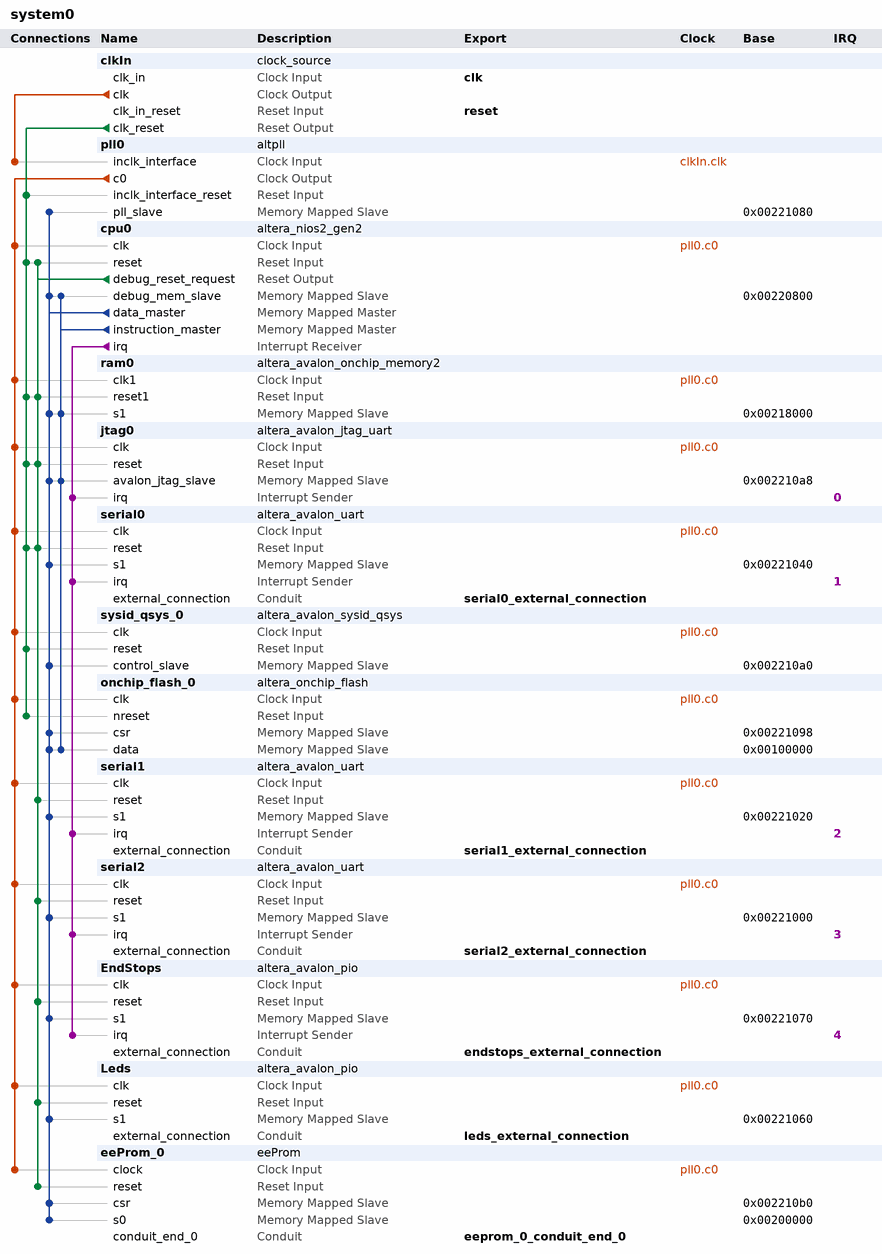
[diagram p0: system contents]
# Platform Designer (Qsys) system system0, MAX 10 10M25SAE144C8G
# Parameters at their usual value, and those the tool derives, are not listed.
package require -exact qsys 18.1
create_system system0
set_project_property DEVICE_FAMILY {MAX 10}
set_project_property DEVICE 10M25SAE144C8G

add_instance clkIn clock_source 18.1
set_instance_parameter_value clkIn clockFrequency 50000000

add_instance pll0 altpll 18.1
set_instance_parameter_value pll0 CLK0_DIVIDE_BY 5
set_instance_parameter_value pll0 CLK0_MULTIPLY_BY 11
set_instance_parameter_value pll0 CLK1_DIVIDE_BY 1
set_instance_parameter_value pll0 CLK1_DUTY_CYCLE 50
set_instance_parameter_value pll0 CLK1_MULTIPLY_BY 1
set_instance_parameter_value pll0 CLK1_PHASE_SHIFT 0
set_instance_parameter_value pll0 CLK2_DIVIDE_BY 2
set_instance_parameter_value pll0 CLK2_DUTY_CYCLE 50
set_instance_parameter_value pll0 CLK2_MULTIPLY_BY 1
set_instance_parameter_value pll0 CLK2_PHASE_SHIFT 0
set_instance_parameter_value pll0 INCLK0_INPUT_FREQUENCY 20000
set_instance_parameter_value pll0 PORT_ARESET PORT_UNUSED
set_instance_parameter_value pll0 PORT_LOCKED PORT_UNUSED
set_instance_parameter_value pll0 PORT_clk1 PORT_USED
set_instance_parameter_value pll0 PORT_clk2 PORT_UNUSED
set_instance_parameter_value pll0 PORT_clk3 PORT_UNUSED

add_instance cpu0 altera_nios2_gen2 18.1
set_instance_parameter_value cpu0 dcache_size 2048
set_instance_parameter_value cpu0 exceptionSlave ram0.s1
set_instance_parameter_value cpu0 icache_size 4096
set_instance_parameter_value cpu0 impl Tiny
set_instance_parameter_value cpu0 resetSlave ram0.s1

add_instance ram0 altera_avalon_onchip_memory2 18.1
set_instance_parameter_value ram0 dataWidth 32
set_instance_parameter_value ram0 dualPort false
set_instance_parameter_value ram0 initMemContent false
set_instance_parameter_value ram0 initializationFileName onchip_mem.hex
set_instance_parameter_value ram0 memorySize 30720

add_instance jtag0 altera_avalon_jtag_uart 18.1
set_instance_parameter_value jtag0 simInteractiveOptions NO_INTERACTIVE_WINDOWS

add_instance serial0 altera_avalon_uart 18.1
set_instance_parameter_value serial0 baud 115200
set_instance_parameter_value serial0 dataBits 8
set_instance_parameter_value serial0 fixedBaud true
set_instance_parameter_value serial0 parity NONE
set_instance_parameter_value serial0 stopBits 1

add_instance sysid_qsys_0 altera_avalon_sysid_qsys 18.1
set_instance_parameter_value sysid_qsys_0 id -1841766281

add_instance onchip_flash_0 altera_onchip_flash 18.1
set_instance_parameter_value onchip_flash_0 CLOCK_FREQUENCY 110.0
set_instance_parameter_value onchip_flash_0 CONFIGURATION_MODE {Single Compressed Image}
set_instance_parameter_value onchip_flash_0 SECTOR_ACCESS_MODE {Read and write,Read and write,Read and write,Read and write,Read and write}
set_instance_parameter_value onchip_flash_0 initFlashContent false
set_instance_parameter_value onchip_flash_0 initializationFileName altera_onchip_flash.hex
set_instance_parameter_value onchip_flash_0 useNonDefaultInitFile false

add_instance serial1 altera_avalon_uart 18.1
set_instance_parameter_value serial1 baud 115200
set_instance_parameter_value serial1 dataBits 8
set_instance_parameter_value serial1 fixedBaud false
set_instance_parameter_value serial1 parity NONE
set_instance_parameter_value serial1 stopBits 1

add_instance serial2 altera_avalon_uart 18.1
set_instance_parameter_value serial2 baud 115200
set_instance_parameter_value serial2 dataBits 8
set_instance_parameter_value serial2 fixedBaud false
set_instance_parameter_value serial2 parity NONE
set_instance_parameter_value serial2 stopBits 1

add_instance EndStops altera_avalon_pio 18.1
set_instance_parameter_value EndStops captureEdge true
set_instance_parameter_value EndStops direction Input
set_instance_parameter_value EndStops generateIRQ true
set_instance_parameter_value EndStops irqType EDGE
set_instance_parameter_value EndStops width 8

add_instance Leds altera_avalon_pio 18.1
set_instance_parameter_value Leds direction Output
set_instance_parameter_value Leds width 4

add_instance eeProm_0 eeProm 1.0
set_instance_parameter_value eeProm_0 i2cClockRate 1000000

# connections
add_connection clkIn.clk pll0.inclk_interface clock
add_connection pll0.c0 cpu0.clk clock
add_connection pll0.c0 eeProm_0.clock clock
add_connection pll0.c0 EndStops.clk clock
add_connection pll0.c0 jtag0.clk clock
add_connection pll0.c0 Leds.clk clock
add_connection pll0.c0 onchip_flash_0.clk clock
add_connection pll0.c0 ram0.clk1 clock
add_connection pll0.c0 serial0.clk clock
add_connection pll0.c0 serial1.clk clock
add_connection pll0.c0 serial2.clk clock
add_connection pll0.c0 sysid_qsys_0.clk clock
add_connection clkIn.clk_reset cpu0.reset reset
add_connection clkIn.clk_reset jtag0.reset reset
add_connection clkIn.clk_reset onchip_flash_0.nreset reset
add_connection clkIn.clk_reset pll0.inclk_interface_reset reset
add_connection clkIn.clk_reset ram0.reset1 reset
add_connection clkIn.clk_reset serial0.reset reset
add_connection clkIn.clk_reset sysid_qsys_0.reset reset
add_connection cpu0.debug_reset_request cpu0.reset reset
add_connection cpu0.debug_reset_request eeProm_0.reset reset
add_connection cpu0.debug_reset_request EndStops.reset reset
add_connection cpu0.debug_reset_request jtag0.reset reset
add_connection cpu0.debug_reset_request Leds.reset reset
add_connection cpu0.debug_reset_request ram0.reset1 reset
add_connection cpu0.debug_reset_request serial0.reset reset
add_connection cpu0.debug_reset_request serial1.reset reset
add_connection cpu0.debug_reset_request serial2.reset reset
add_connection cpu0.data_master cpu0.debug_mem_slave avalon
set_connection_parameter_value cpu0.data_master/cpu0.debug_mem_slave baseAddress 0x00220800
add_connection cpu0.data_master eeProm_0.csr avalon
set_connection_parameter_value cpu0.data_master/eeProm_0.csr baseAddress 0x002210b0
add_connection cpu0.data_master eeProm_0.s0 avalon
set_connection_parameter_value cpu0.data_master/eeProm_0.s0 baseAddress 0x00200000
add_connection cpu0.data_master EndStops.s1 avalon
set_connection_parameter_value cpu0.data_master/EndStops.s1 baseAddress 0x00221070
add_connection cpu0.data_master jtag0.avalon_jtag_slave avalon
set_connection_parameter_value cpu0.data_master/jtag0.avalon_jtag_slave baseAddress 0x002210a8
add_connection cpu0.data_master Leds.s1 avalon
set_connection_parameter_value cpu0.data_master/Leds.s1 baseAddress 0x00221060
add_connection cpu0.data_master onchip_flash_0.csr avalon
set_connection_parameter_value cpu0.data_master/onchip_flash_0.csr baseAddress 0x00221098
add_connection cpu0.data_master onchip_flash_0.data avalon
set_connection_parameter_value cpu0.data_master/onchip_flash_0.data baseAddress 0x00100000
add_connection cpu0.data_master pll0.pll_slave avalon
set_connection_parameter_value cpu0.data_master/pll0.pll_slave baseAddress 0x00221080
add_connection cpu0.data_master ram0.s1 avalon
set_connection_parameter_value cpu0.data_master/ram0.s1 baseAddress 0x00218000
add_connection cpu0.data_master serial0.s1 avalon
set_connection_parameter_value cpu0.data_master/serial0.s1 baseAddress 0x00221040
add_connection cpu0.data_master serial1.s1 avalon
set_connection_parameter_value cpu0.data_master/serial1.s1 baseAddress 0x00221020
add_connection cpu0.data_master serial2.s1 avalon
set_connection_parameter_value cpu0.data_master/serial2.s1 baseAddress 0x00221000
add_connection cpu0.data_master sysid_qsys_0.control_slave avalon
set_connection_parameter_value cpu0.data_master/sysid_qsys_0.control_slave baseAddress 0x002210a0
add_connection cpu0.instruction_master cpu0.debug_mem_slave avalon
set_connection_parameter_value cpu0.instruction_master/cpu0.debug_mem_slave baseAddress 0x00220800
add_connection cpu0.instruction_master jtag0.avalon_jtag_slave avalon
set_connection_parameter_value cpu0.instruction_master/jtag0.avalon_jtag_slave baseAddress 0x002210a8
add_connection cpu0.instruction_master onchip_flash_0.data avalon
set_connection_parameter_value cpu0.instruction_master/onchip_flash_0.data baseAddress 0x00100000
add_connection cpu0.instruction_master ram0.s1 avalon
set_connection_parameter_value cpu0.instruction_master/ram0.s1 baseAddress 0x00218000
add_connection cpu0.irq EndStops.irq interrupt
set_connection_parameter_value cpu0.irq/EndStops.irq irqNumber 4
add_connection cpu0.irq jtag0.irq interrupt
set_connection_parameter_value cpu0.irq/jtag0.irq irqNumber 0
add_connection cpu0.irq serial0.irq interrupt
set_connection_parameter_value cpu0.irq/serial0.irq irqNumber 1
add_connection cpu0.irq serial1.irq interrupt
set_connection_parameter_value cpu0.irq/serial1.irq irqNumber 2
add_connection cpu0.irq serial2.irq interrupt
set_connection_parameter_value cpu0.irq/serial2.irq irqNumber 3

# exported interfaces
add_interface clk clock sink
set_interface_property clk EXPORT_OF clkIn.clk_in
add_interface eeprom_0_conduit_end_0 conduit end
set_interface_property eeprom_0_conduit_end_0 EXPORT_OF eeProm_0.conduit_end_0
add_interface endstops_external_connection conduit end
set_interface_property endstops_external_connection EXPORT_OF EndStops.external_connection
add_interface leds_external_connection conduit end
set_interface_property leds_external_connection EXPORT_OF Leds.external_connection
add_interface reset reset sink
set_interface_property reset EXPORT_OF clkIn.clk_in_reset
add_interface serial0_external_connection conduit end
set_interface_property serial0_external_connection EXPORT_OF serial0.external_connection
add_interface serial1_external_connection conduit end
set_interface_property serial1_external_connection EXPORT_OF serial1.external_connection
add_interface serial2_external_connection conduit end
set_interface_property serial2_external_connection EXPORT_OF serial2.external_connection

set_interconnect_requirement {$system} qsys_mm.clockCrossingAdapter HANDSHAKE
set_interconnect_requirement {$system} qsys_mm.enableEccProtection FALSE
set_interconnect_requirement {$system} qsys_mm.insertDefaultSlave FALSE
set_interconnect_requirement {$system} qsys_mm.maxAdditionalLatency 1

save_system system0.qsys
